# Altium schematic sheet oai_cm_ext.SchDoc: =GlobalProjectName
size 410 x 297 mm; SheetNumber: 1; SheetTotal: 7; PageSetup: Record=PageOptions|CenterHorizontal=True|CenterVertical=True|PrintScale=1.00|XCorrection=1.00|YCorrection=1.00|PrintKind=1|BorderSize=5000000|LeftOffset=0|BottomOffset=0|Orientation=2|PaperLength=1000|PaperWidth=1000|Scale=100|PaperSource=15|PrintQuality=1200|MediaType=1|DitherType=10|PaperKind=A3|PrintScaleMode=1; Weight: -; ScaleFactor: -
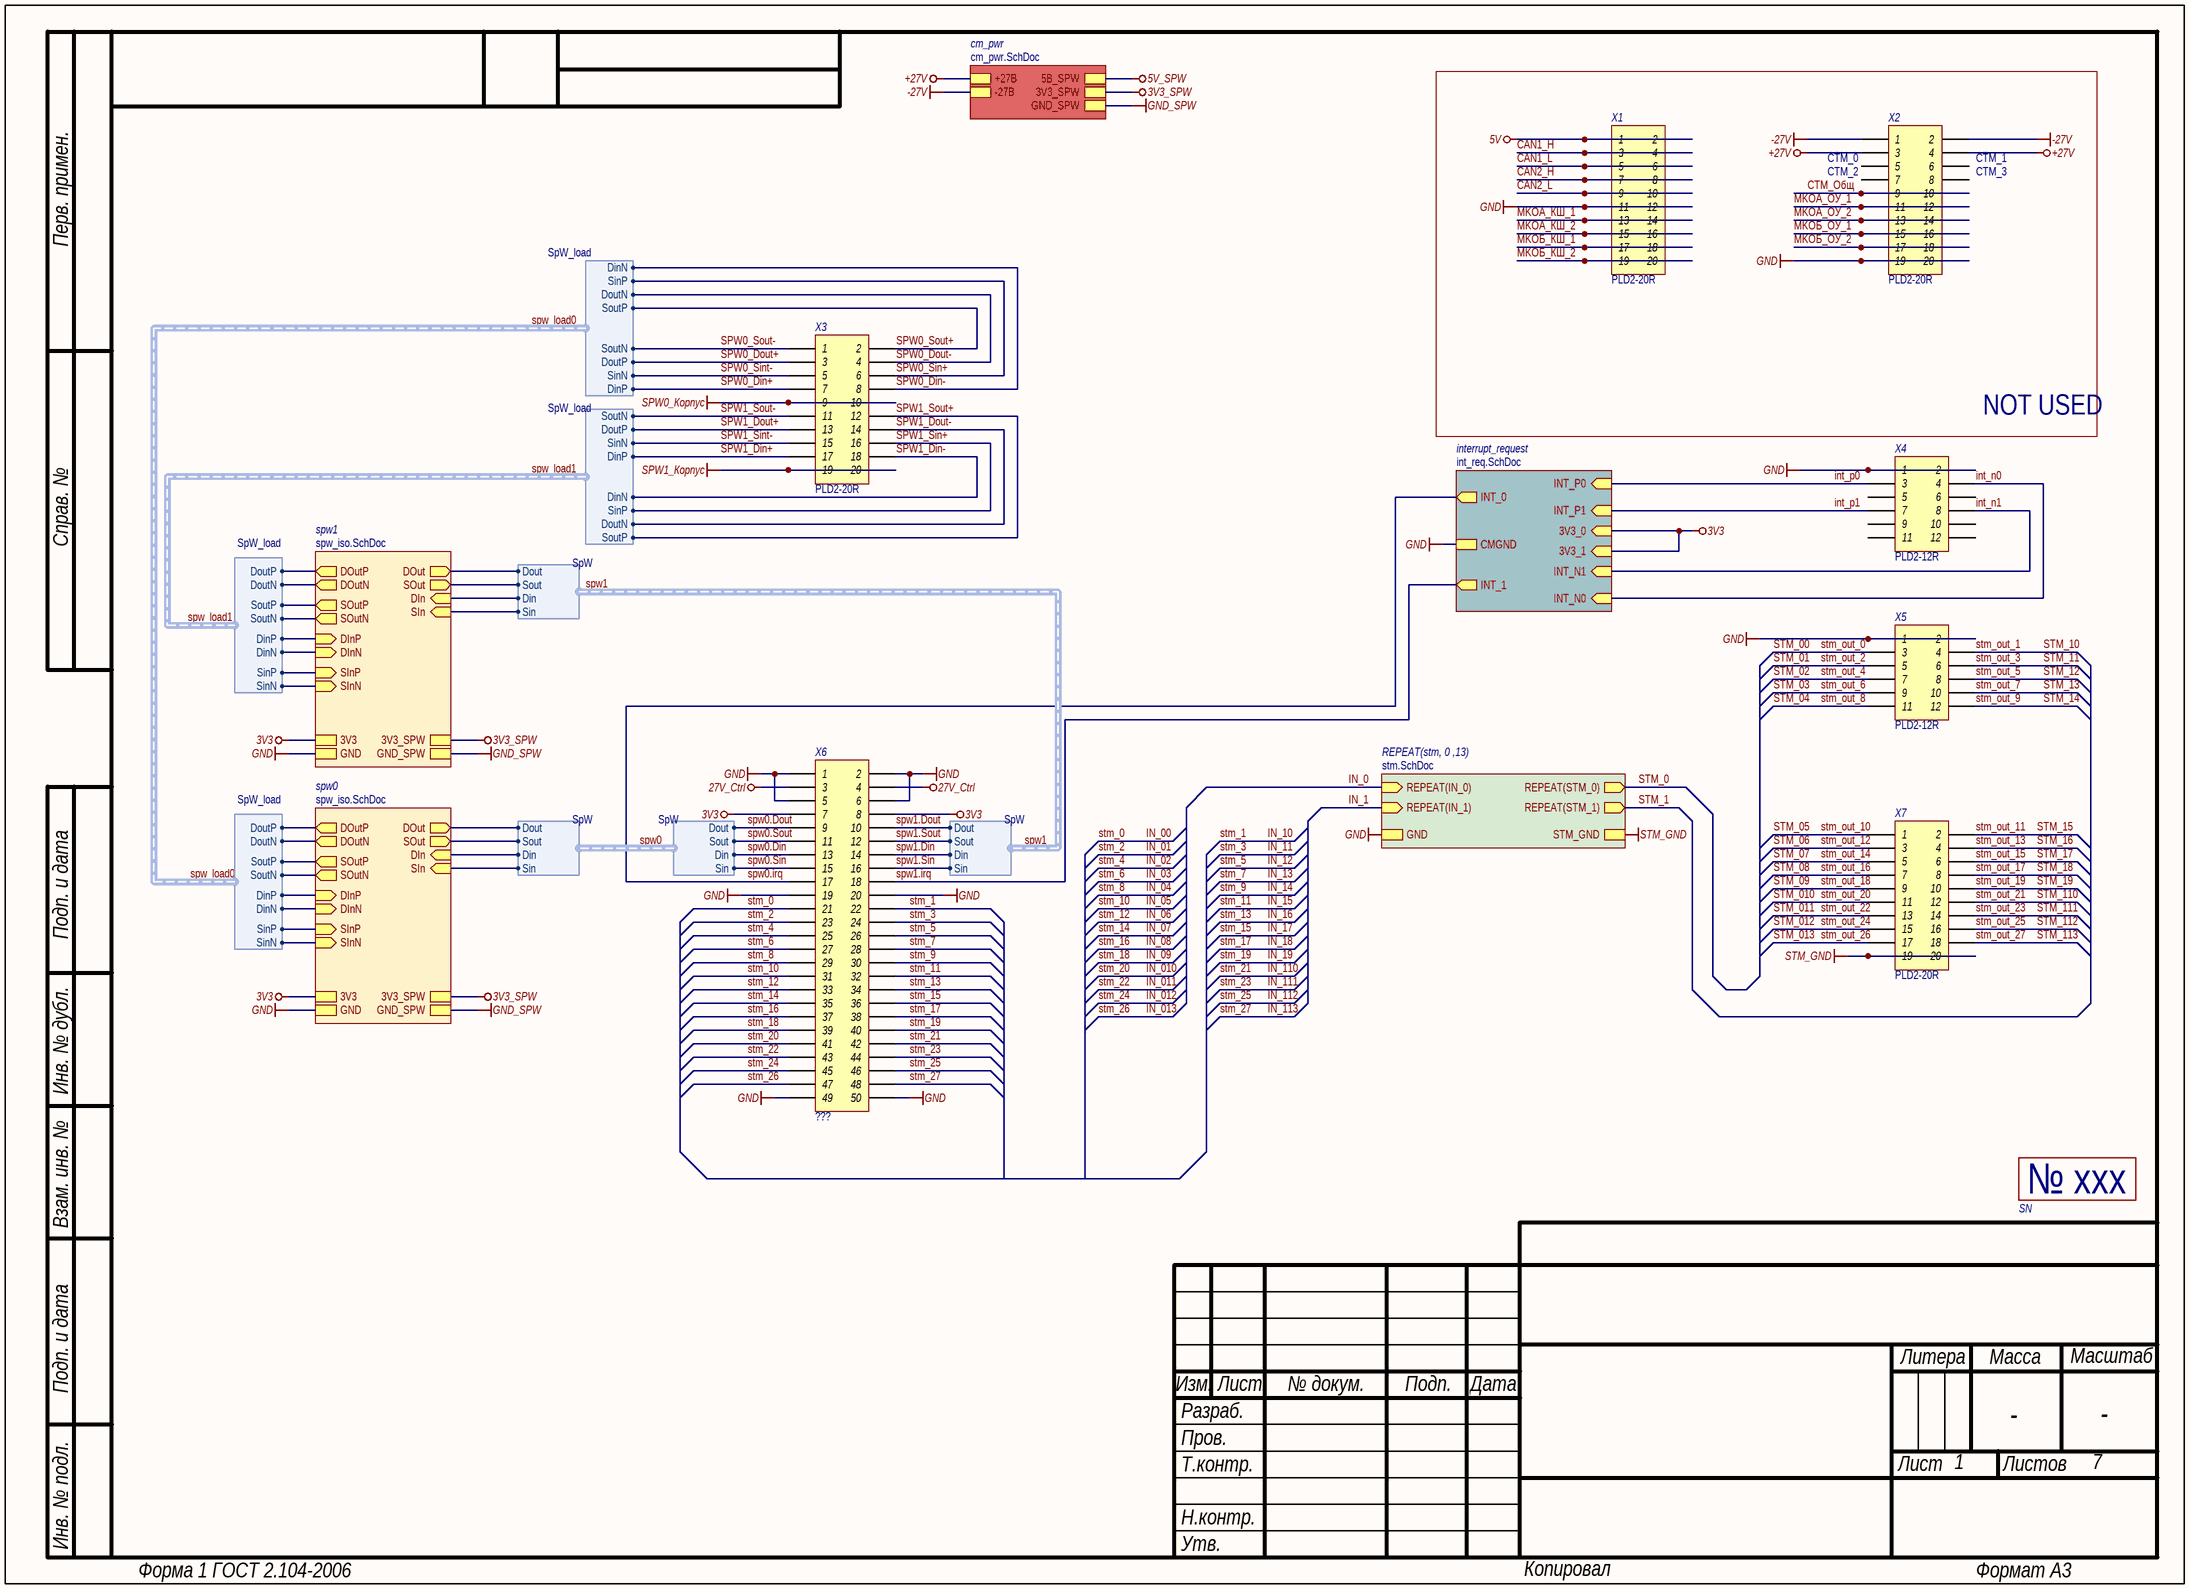
[diagram p0: oai_cm_ext.SchDoc]

## Parts
SN  Место под нанесение серийного номера  [Serial_number_v1]  (value not drawn)
X1  Header 2X20  [PLD2-20R]  (value not drawn)
X2  Header 2X20  [PLD2-20R]  (value not drawn)
X3  Header 2X20  [PLD2-20R]  (value not drawn)
X4  Header 2X12  [PLD2-12R]  (value not drawn)
X5  Header 2X12  [PLD2-12R]  (value not drawn)
X6  Наименование: ???  [PBD50]  (hidden comment: Header 2X50)
X7  Header 2X20  [PLD2-20R]  (value not drawn)

## Blocks framed on the sheet
NOT USED: X1 X2

## Sub-sheets
cm_pwr = cm_pwr.SchDoc: +27В, -27В, 5В_SPW, 3V3_SPW, GND_SPW
interrupt_request = int_req.SchDoc: INT_1 (out), 3V3_1 (in), INT_P1 (in), INT_N1 (in), INT_0 (out), 3V3_0 (in), INT_P0 (in), INT_N0 (in), CMGND
REPEAT(stm, 0 ,13) = stm.SchDoc: GND, STM_GND, REPEAT(STM_1) (out), REPEAT(IN_1) (in), REPEAT(STM_0) (out), REPEAT(IN_0) (in)
spw0 = spw_iso.SchDoc: DOutN (out), DOutP (out), SOutP (out), SInP (in), SInN (in), SOutN (out), DInN (in), DInP (in), GND, 3V3, 3V3_SPW, GND_SPW, DOut (out), SOut (out), DIn (in), SIn (in)
spw1 = spw_iso.SchDoc: DOutN (out), DOutP (out), SOutP (out), SInP (in), SInN (in), SOutN (out), DInN (in), DInP (in), GND, 3V3, 3V3_SPW, GND_SPW, DOut (out), SOut (out), DIn (in), SIn (in)

## Harnesses
SpW: Dout, Sout, Din, Sin
SpW_load: DinN, SinP, DoutN, SoutP, SoutN, DoutP, SinN, DinP

## Nets
3V3: X6.7 X6.8 ; sheet spw0/3V3, sheet spw1/3V3, sheet interrupt_request/3V3_1, sheet interrupt_request/3V3_0
3V3_SPW: sheet spw0/3V3_SPW, sheet cm_pwr/3V3_SPW, sheet spw1/3V3_SPW
5V: X1.1 X1.2
5V_SPW: sheet cm_pwr/5В_SPW
27V_Ctrl: X6.3 X6.4
+27V: X2.3 X2.4 ; sheet cm_pwr/+27В
-27V: X2.1 X2.2 ; sheet cm_pwr/-27В
GND: X1.11 X1.12 X2.19 X2.20 X4.1 X4.2 X5.1 X5.2 X6.1 X6.2 X6.5 X6.6 X6.19 X6.20 X6.49 X6.50 ; sheet spw0/GND, sheet REPEAT(stm, 0 ,13)/GND, sheet spw1/GND, sheet interrupt_request/CMGND
GND_SPW: sheet spw0/GND_SPW, sheet cm_pwr/GND_SPW, sheet spw1/GND_SPW
SPW0_Корпус: X3.9 X3.10
SPW1_Корпус: X3.19 X3.20
STM_GND: X7.19 X7.20 ; sheet REPEAT(stm, 0 ,13)/STM_GND
CAN1_H: X1.3 X1.4
CAN1_L: X1.5 X1.6
CAN2_H: X1.7 X1.8
CAN2_L: X1.9 X1.10
IN_00: X6.21 ; sheet REPEAT(stm, 0 ,13)/REPEAT(STM_0)  [also labelled stm_0]
IN_0: sheet REPEAT(stm, 0 ,13)/REPEAT(IN_0)
IN_01: X6.23  [also labelled stm_2]
IN_1: sheet REPEAT(stm, 0 ,13)/REPEAT(IN_1)
IN_02: X6.25  [also labelled stm_4]
IN_03: X6.27  [also labelled stm_6]
IN_04: X6.29  [also labelled stm_8]
IN_05: X5.4 X6.31  [also labelled stm_10, stm_out_1]
IN_06: X5.8 X6.33  [also labelled stm_12, stm_out_5]
IN_07: X5.12 X6.35  [also labelled stm_14, stm_out_9]
IN_08: X6.37 X7.4  [also labelled stm_16, stm_out_13]
IN_09: X6.39 X7.8  [also labelled stm_18, stm_out_17]
IN_10: X6.22 ; sheet REPEAT(stm, 0 ,13)/REPEAT(STM_1)  [also labelled stm_1]
IN_010: X6.41  [also labelled stm_20]
IN_11: X6.24  [also labelled stm_3]
IN_011: X6.43  [also labelled stm_22]
IN_12: X6.26  [also labelled stm_5]
IN_012: X6.45  [also labelled stm_24]
IN_13: X6.28  [also labelled stm_7]
IN_013: X6.47  [also labelled stm_26]
IN_14: X6.30  [also labelled stm_9]
IN_15: X5.6 X6.32  [also labelled stm_11, stm_out_3]
IN_16: X5.10 X6.34  [also labelled stm_13, stm_out_7]
IN_17: X6.36 X7.2  [also labelled stm_15, stm_out_11]
IN_18: X6.38 X7.6  [also labelled stm_17, stm_out_15]
IN_19: X6.40 X7.10  [also labelled stm_19, stm_out_19]
IN_110: X6.42  [also labelled stm_21]
IN_111: X6.44  [also labelled stm_23]
IN_112: X6.46  [also labelled stm_25]
IN_113: X6.48  [also labelled stm_27]
int_n0: X4.4 ; sheet interrupt_request/INT_N0
int_n1: X4.8 ; sheet interrupt_request/INT_N1
int_p0: X4.3 ; sheet interrupt_request/INT_P0
int_p1: X4.7 ; sheet interrupt_request/INT_P1
MKOА_КШ_1: X1.13 X1.14
MKOА_КШ_2: X1.15 X1.16
MKOА_ОУ_1: X2.11 X2.12
MKOА_ОУ_2: X2.13 X2.14
MKOБ_КШ_1: X1.17 X1.18
MKOБ_КШ_2: X1.19 X1.20
MKOБ_ОУ_1: X2.15 X2.16
MKOБ_ОУ_2: X2.17 X2.18
spw0.Din: X6.13 ; sheet spw0/DIn, harness SpW.Din
spw0.Dout: X6.9 ; sheet spw0/DOut, harness SpW.Dout
spw0.irq: X6.17 ; sheet interrupt_request/INT_0
spw0.Sin: X6.15 ; sheet spw0/SIn, harness SpW.Sin
spw0.Sout: X6.11 ; sheet spw0/SOut, harness SpW.Sout
SPW0_Din+: X3.7 ; sheet spw0/DInP, harness SpW_load.DinP
SPW0_Din-: X3.8 ; sheet spw0/DInN, harness SpW_load.DinN
SPW0_Dout+: X3.3 ; sheet spw0/DOutP, harness SpW_load.DoutP
SPW0_Dout-: X3.4 ; sheet spw0/DOutN, harness SpW_load.DoutN
SPW0_Sin+: X3.6 ; sheet spw0/SInP, harness SpW_load.SinP
SPW0_Sint-: X3.5 ; sheet spw0/SInN, harness SpW_load.SinN
SPW0_Sout+: X3.2 ; sheet spw0/SOutP, harness SpW_load.SoutP
SPW0_Sout-: X3.1 ; sheet spw0/SOutN, harness SpW_load.SoutN
spw1.Din: X6.14 ; sheet spw1/DIn, harness SpW.Din
spw1.Dout: X6.10 ; sheet spw1/DOut, harness SpW.Dout
spw1.irq: X6.18 ; sheet interrupt_request/INT_1
spw1.Sin: X6.16 ; sheet spw1/SIn, harness SpW.Sin
spw1.Sout: X6.12 ; sheet spw1/SOut, harness SpW.Sout
SPW1_Din+: X3.17 ; sheet spw1/DInP, harness SpW_load.DinP
SPW1_Din-: X3.18 ; sheet spw1/DInN, harness SpW_load.DinN
SPW1_Dout+: X3.13 ; sheet spw1/DOutP, harness SpW_load.DoutP
SPW1_Dout-: X3.14 ; sheet spw1/DOutN, harness SpW_load.DoutN
SPW1_Sin+: X3.16 ; sheet spw1/SInP, harness SpW_load.SinP
SPW1_Sint-: X3.15 ; sheet spw1/SInN, harness SpW_load.SinN
SPW1_Sout+: X3.12 ; sheet spw1/SOutP, harness SpW_load.SoutP
SPW1_Sout-: X3.11 ; sheet spw1/SOutN, harness SpW_load.SoutN
STM_00: X5.3  [also labelled stm_out_0]
STM_01: X5.5  [also labelled stm_out_2]
STM_02: X5.7  [also labelled stm_out_4]
STM_03: X5.9  [also labelled stm_out_6]
STM_04: X5.11  [also labelled stm_out_8]
STM_05: X7.1  [also labelled stm_out_10]
STM_06: X7.3  [also labelled stm_out_12]
STM_07: X7.5  [also labelled stm_out_14]
STM_08: X7.7  [also labelled stm_out_16]
STM_09: X7.9  [also labelled stm_out_18]
STM_010: X7.11  [also labelled stm_out_20]
STM_011: X7.13  [also labelled stm_out_22]
STM_012: X7.15  [also labelled stm_out_24]
STM_013: X7.17  [also labelled stm_out_26]
STM_110: X7.12  [also labelled stm_out_21]
STM_111: X7.14  [also labelled stm_out_23]
STM_112: X7.16  [also labelled stm_out_25]
STM_113: X7.18  [also labelled stm_out_27]
СТМ_Общ: X2.9 X2.10

Not connected (* = marked no-connect by the designer): X2 5 6 7 8; X4 5 6 9 10 11 12

## Notes on the sheet
- (near X2) СТМ_0
- (near X2) СТМ_2
- (near X2) СТМ_1
- (near X2) СТМ_3
- Перв. примен.
- Справ. №
- Подп. и дата
- Инв. № дубл.
- Взам. инв. №
- Изм.
- Разраб.
- Лист
- № докум.
- Подп.
- Дата
- Литера
- Масса
- Масштаб
- Пров.
- Т.контр.
- Листов
- Н.контр.
- Утв.
- Инв. № подл.
- Форма 1 ГОСТ 2.104-2006
- Копировал
- Формат А3
- (in symbol Serial_number) № xxx

## Library data of the parts
SN = Serial_number: Потребление, Вт: 0; Назначение: Место под нанесение серийного номера; Наименование: Место под нанесение серийного номера
X1-X3 X7 = Header 2X20: Header, 20-Pin, Dual row; Потребление, Вт: 0,0; Назначение: Header, 20-Pin, Dual row; Наименование: PLD2-20R
X4 X5 = Header 2X12: Header, 12-Pin, Dual row; Потребление, Вт: 0,0; Назначение: Header, 12-Pin, Dual row; Наименование: PLD2-12R
X6 = Header 2X50: Header, 50-Pin, Dual row; Потребление, Вт: 0,0; Назначение: Header, 50-Pin, Dual row